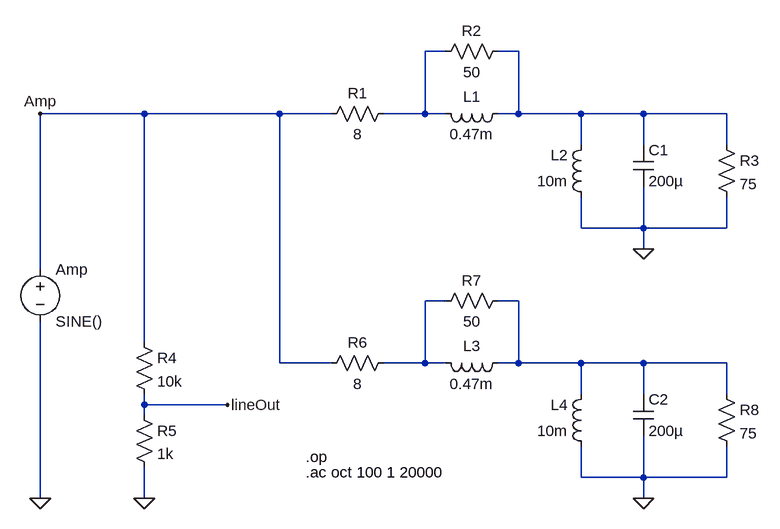
[diagram p0: schematic 4ohm simulation.asc]
4ohm simulation.asc, the LTspice schematic file:
Version 4
SHEET 1 1716 1168
WIRE 304 -144 272 -144
WIRE 416 -144 384 -144
WIRE -160 -48 -320 -48
WIRE 48 -48 -160 -48
WIRE 128 -48 48 -48
WIRE 272 -48 272 -144
WIRE 272 -48 208 -48
WIRE 304 -48 272 -48
WIRE 416 -48 416 -144
WIRE 416 -48 384 -48
WIRE 512 -48 416 -48
WIRE 608 -48 512 -48
WIRE 736 -48 608 -48
WIRE 512 0 512 -48
WIRE 608 0 608 -48
WIRE 736 0 736 -48
WIRE 512 128 512 80
WIRE 608 128 608 64
WIRE 608 128 512 128
WIRE 736 128 736 80
WIRE 736 128 608 128
WIRE 608 160 608 128
WIRE -320 192 -320 -48
WIRE 304 240 272 240
WIRE 416 240 384 240
WIRE -160 304 -160 -48
WIRE 48 336 48 -48
WIRE 128 336 48 336
WIRE 272 336 272 240
WIRE 272 336 208 336
WIRE 304 336 272 336
WIRE 416 336 416 240
WIRE 416 336 384 336
WIRE 512 336 416 336
WIRE 608 336 512 336
WIRE 736 336 608 336
WIRE 512 384 512 336
WIRE 608 384 608 336
WIRE 736 384 736 336
WIRE -160 400 -160 384
WIRE -32 400 -160 400
WIRE -160 416 -160 400
WIRE 512 512 512 464
WIRE 608 512 608 448
WIRE 608 512 512 512
WIRE 736 512 736 464
WIRE 736 512 608 512
WIRE -320 544 -320 272
WIRE -160 544 -160 496
WIRE 608 544 608 512
FLAG -320 544 0
FLAG -160 544 0
FLAG -32 400 lineOut
FLAG -320 -48 Amp
FLAG 608 544 0
FLAG 608 160 0
SYMBOL res 224 -64 R90
WINDOW 0 0 56 VBottom 2
WINDOW 3 32 56 VTop 2
SYMATTR InstName R1
SYMATTR Value 8
SYMBOL res 288 -128 R270
WINDOW 0 32 56 VTop 2
WINDOW 3 0 56 VBottom 2
SYMATTR InstName R2
SYMATTR Value 50
SYMBOL res 720 -16 R0
SYMATTR InstName R3
SYMATTR Value 75
SYMBOL ind 400 -64 R90
WINDOW 0 5 56 VBottom 2
WINDOW 3 32 56 VTop 2
SYMATTR InstName L1
SYMATTR Value 0.47m
SYMBOL ind 528 96 R180
WINDOW 0 36 80 Left 2
WINDOW 3 36 40 Left 2
SYMATTR InstName L2
SYMATTR Value 10m
SYMBOL cap 592 0 R0
SYMATTR InstName C1
SYMATTR Value 200µ
SYMBOL voltage -320 176 R0
SYMATTR InstName Amp
SYMATTR Value SINE()
SYMATTR Value2 AC 20
SYMBOL res -176 288 R0
SYMATTR InstName R4
SYMATTR Value 10k
SYMBOL res -176 400 R0
SYMATTR InstName R5
SYMATTR Value 1k
SYMBOL res 224 320 R90
WINDOW 0 0 56 VBottom 2
WINDOW 3 32 56 VTop 2
SYMATTR InstName R6
SYMATTR Value 8
SYMBOL res 288 256 R270
WINDOW 0 32 56 VTop 2
WINDOW 3 0 56 VBottom 2
SYMATTR InstName R7
SYMATTR Value 50
SYMBOL res 720 368 R0
SYMATTR InstName R8
SYMATTR Value 75
SYMBOL ind 400 320 R90
WINDOW 0 5 56 VBottom 2
WINDOW 3 32 56 VTop 2
SYMATTR InstName L3
SYMATTR Value 0.47m
SYMBOL ind 528 480 R180
WINDOW 0 36 80 Left 2
WINDOW 3 36 40 Left 2
SYMATTR InstName L4
SYMATTR Value 10m
SYMBOL cap 592 384 R0
SYMATTR InstName C2
SYMATTR Value 200µ
TEXT 88 480 Left 2 !.op
TEXT 88 504 Left 2 !.ac oct 100 1 20000

The netlist it stands for:
* 4ohm simulation.asc
R1 N001 Amp 8
R2 N001 N002 50
R3 N002 0 75
L1 N002 N001 0.47m
L2 0 N002 10m
C1 N002 0 200µ
V§Amp Amp 0 SINE() AC 20
R4 Amp lineOut 10k
R5 lineOut 0 1k
R6 N003 Amp 8
R7 N003 N004 50
R8 N004 0 75
L3 N004 N003 0.47m
L4 0 N004 10m
C2 N004 0 200µ
.op
.ac oct 100 1 20000
.backanno
.end